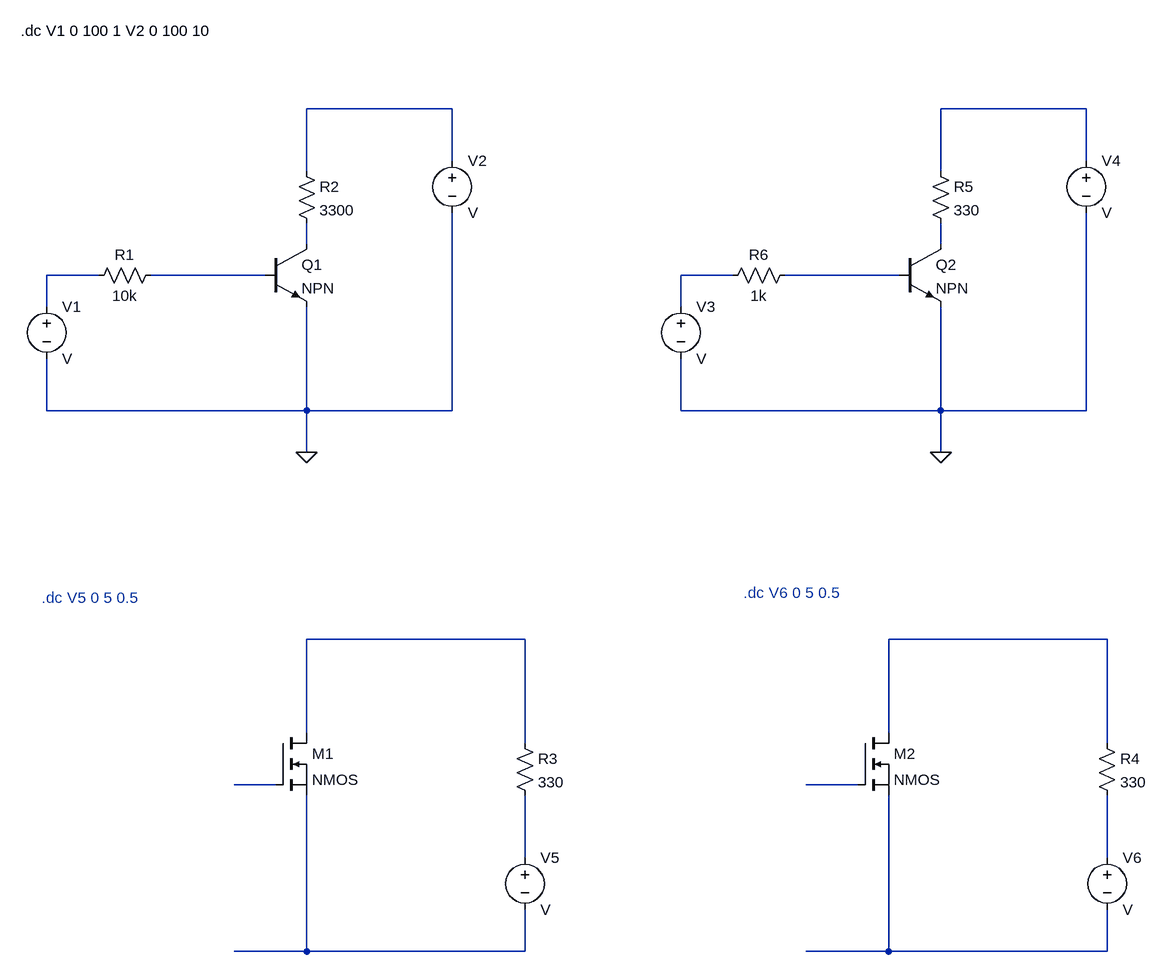
[diagram p0: schematic Power Transistors.asc]
Power Transistors.asc, the LTspice schematic file:
Version 4
SHEET 1 2488 1304
WIRE 464 0 240 0
WIRE 1440 0 1216 0
WIRE 464 80 464 0
WIRE 1440 80 1440 0
WIRE 240 96 240 0
WIRE 1216 96 1216 0
WIRE 240 208 240 176
WIRE 1216 208 1216 176
WIRE -80 256 -160 256
WIRE 176 256 0 256
WIRE 896 256 816 256
WIRE 1152 256 976 256
WIRE -160 304 -160 256
WIRE 816 304 816 256
WIRE -160 464 -160 384
WIRE 240 464 240 304
WIRE 240 464 -160 464
WIRE 464 464 464 160
WIRE 464 464 240 464
WIRE 816 464 816 384
WIRE 1216 464 1216 304
WIRE 1216 464 816 464
WIRE 1440 464 1440 160
WIRE 1440 464 1216 464
WIRE 240 528 240 464
WIRE 1216 528 1216 464
WIRE 576 816 240 816
WIRE 1472 816 1136 816
WIRE 240 960 240 816
WIRE 1136 960 1136 816
WIRE 576 976 576 816
WIRE 1472 976 1472 816
WIRE 192 1040 128 1040
WIRE 1088 1040 1008 1040
WIRE 576 1152 576 1056
WIRE 1472 1152 1472 1056
WIRE 240 1296 240 1056
WIRE 240 1296 128 1296
WIRE 576 1296 576 1232
WIRE 576 1296 240 1296
WIRE 1136 1296 1136 1056
WIRE 1136 1296 1008 1296
WIRE 1472 1296 1472 1232
WIRE 1472 1296 1136 1296
FLAG 240 528 0
FLAG 1216 528 0
SYMBOL npn 176 208 R0
SYMATTR InstName Q1
SYMBOL res 224 80 R0
SYMATTR InstName R2
SYMATTR Value 3300
SYMBOL res 16 240 R90
WINDOW 0 0 56 VBottom 2
WINDOW 3 32 56 VTop 2
SYMATTR InstName R1
SYMATTR Value 10k
SYMBOL voltage -160 288 R0
SYMATTR InstName V1
SYMBOL voltage 464 64 R0
SYMATTR InstName V2
SYMBOL npn 1152 208 R0
SYMATTR InstName Q2
SYMBOL res 1200 80 R0
SYMATTR InstName R5
SYMATTR Value 330
SYMBOL res 992 240 R90
WINDOW 0 0 56 VBottom 2
WINDOW 3 32 56 VTop 2
SYMATTR InstName R6
SYMATTR Value 1k
SYMBOL voltage 816 288 R0
SYMATTR InstName V3
SYMBOL voltage 1440 64 R0
SYMATTR InstName V4
SYMBOL nmos 192 960 R0
SYMATTR InstName M1
SYMBOL res 560 960 R0
SYMATTR InstName R3
SYMATTR Value 330
SYMBOL voltage 576 1136 R0
SYMATTR InstName V5
SYMBOL nmos 1088 960 R0
SYMATTR InstName M2
SYMBOL res 1456 960 R0
SYMATTR InstName R4
SYMATTR Value 330
SYMBOL voltage 1472 1136 R0
SYMATTR InstName V6
TEXT -200 -120 Left 2 !.dc V1 0 100 1 V2 0 100 10
TEXT -168 752 Left 2 ;.dc V5 0 5 0.5
TEXT 912 744 Left 2 ;.dc V6 0 5 0.5

The netlist it stands for:
* Power Transistors.asc
Q1 N003 N006 0 0 NPN
R2 N001 N003 3300
R1 N006 N005 10k
V1 N005 0 V
V2 N001 0 V
Q2 N004 N008 0 0 NPN
R5 N002 N004 330
R6 N008 N007 1k
V3 N007 0 V
V4 N002 0 V
M1 N009 N011 N015 N015 NMOS
R3 N009 N013 330
V5 N013 N015 V
M2 N010 N012 N016 N016 NMOS
R4 N010 N014 330
V6 N014 N016 V
.model NPN NPN
.model PNP PNP
.lib standard.bjt
.model NMOS NMOS
.model PMOS PMOS
.lib standard.mos
.dc V1 0 100 1 V2 0 100 10
* .dc V5 0 5 0.5
* .dc V6 0 5 0.5
.backanno
.end